# EAGLE design atmega8 dev board (EAGLE 5.01)
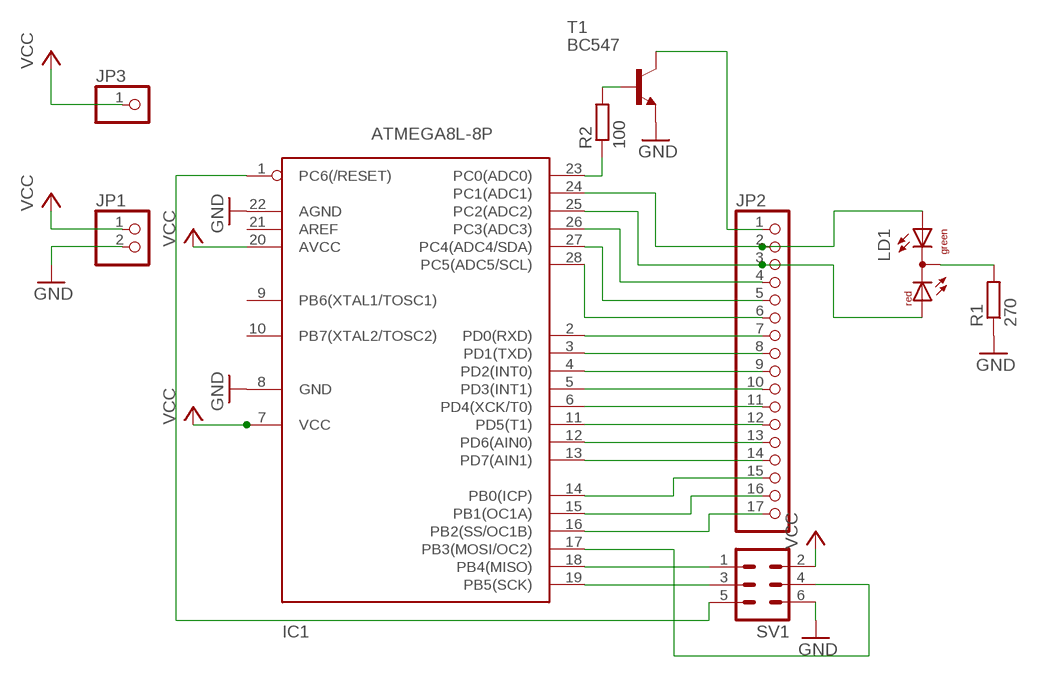
[diagram p0: schematic, sheet 1]

## Parts
IC1  ATMEGA8L-8P  [DIL28-3]
JP1  PINHD-1X2  [1X02]
JP2  PINHD-1X17  [1X17]
JP3  PINHD-1X1  [1X01]
LD1  DUOLED-RG-C  [DUOLED-C-5MM]
R1  270  R-EU_0207/10  [0207/10]
R2  100  R-EU_0207/10  [0207/10]
SV1  MA03-2  [MA03-2]
T1  BC547  [TO92]

## Nets
GND: IC1.8(GND) IC1.22(AGND) JP1.2 R1.1 SV1.6 T1.1(E)
N$1: IC1.18(PB4(MISO)) SV1.1
N$2: IC1.19(PB5(SCK)) SV1.3
N$3: IC1.23(PC0(ADC0)) R2.1
N$4: IC1.17(PB3(MOSI/OC2)) SV1.4
N$5: IC1.1(PC6(/RESET)) SV1.5
N$6: R2.2 T1.2(B)
N$7: IC1.16(PB2(SS/OC1B)) JP2.17
N$8: IC1.15(PB1(OC1A)) JP2.16
N$9: IC1.14(PB0(ICP)) JP2.15
N$10: IC1.13(PD7(AIN1)) JP2.14
N$11: IC1.12(PD6(AIN0)) JP2.13
N$12: IC1.11(PD5(T1)) JP2.12
N$13: IC1.6(PD4(XCK/T0)) JP2.11
N$14: IC1.5(PD3(INT1)) JP2.10
N$15: IC1.4(PD2(INT0)) JP2.9
N$16: IC1.3(PD1(TXD)) JP2.8
N$17: IC1.2(PD0(RXD)) JP2.7
N$18: IC1.28(PC5(ADC5/SCL)) JP2.6
N$19: IC1.27(PC4(ADC4/SDA)) JP2.5
N$20: IC1.26(PC3(ADC3)) JP2.4
N$21: IC1.25(PC2(ADC2)) JP2.3 LD1.AR
N$22: IC1.24(PC1(ADC1)) JP2.2 LD1.AX(AG)
N$23: JP2.1 T1.3(C)
N$24: LD1.C R1.2
VCC: IC1.7(VCC) IC1.20(AVCC) JP1.1 JP3.1 SV1.2
Unconnected: IC1.9(PB6(XTAL1/TOSC1)) IC1.10(PB7(XTAL2/TOSC2)) IC1.21(AREF)

## Library data of the parts
IC1 = avr:ATMEGA8*P: MICROCONTROLLER 8 Kbytes FLASH 1 kbytes SRAM 512 bytes EEPROM USART 4-channel 10 bit ADC 2-channel 8 bit ADC
JP1 = pinhead:PINHD-1X2: PIN HEADER
JP2 = pinhead:PINHD-1X17: PIN HEADER
JP3 = pinhead:PINHD-1X1: PIN HEADER
LD1 = led:DUOLED-RG-C: DUO LED 2 colors (red/green), 5 mm, round, common Cathode www.ligitek.com or other producers.
R1 = resistor:R-EU_: RESISTOR, European symbol
R2 = rcl:R-EU_: RESISTOR, European symbol
SV1 = con-lstb:MA03-2: PIN HEADER
T1 = transistor:BC547: NPN TRANSISTOR

## Board
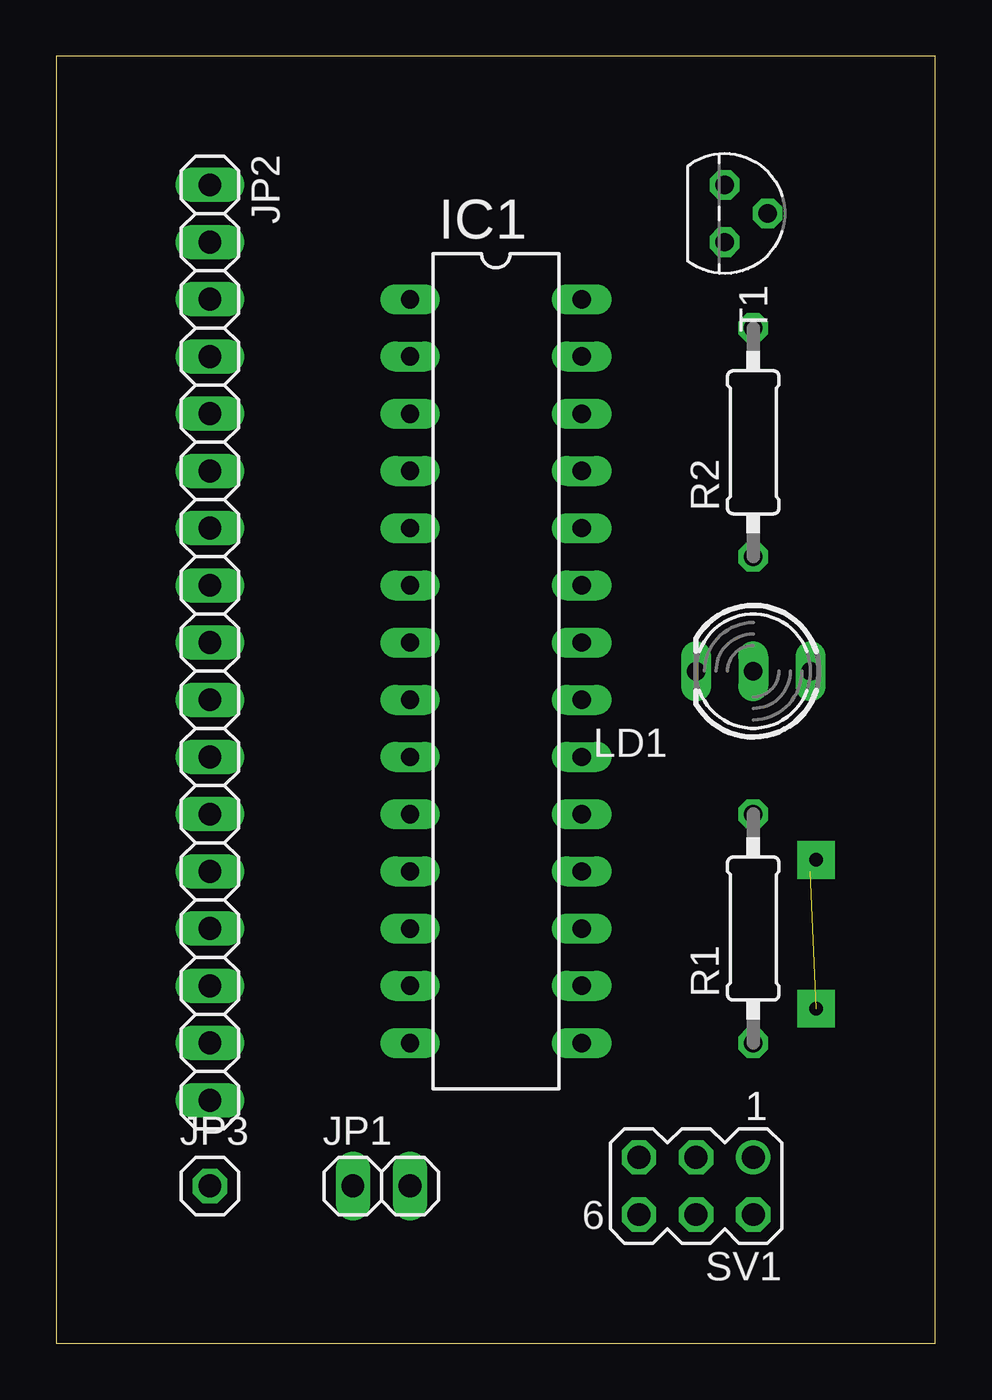
[diagram p1: board, top side]
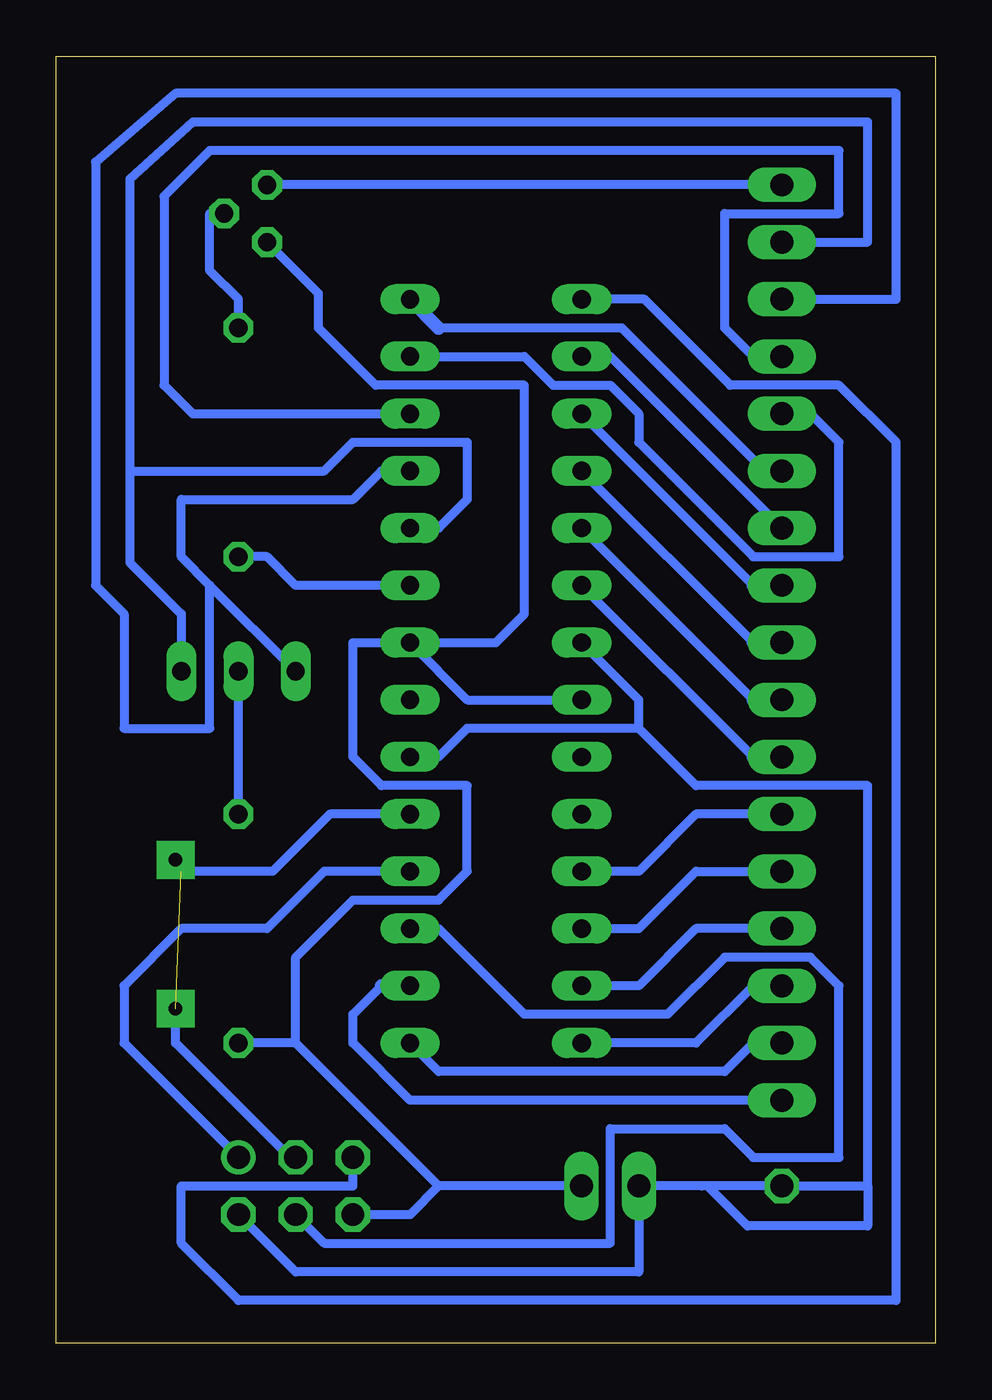
[diagram p2: board, bottom side, seen from below]

Size 39.04 x 57.14 mm. Coordinates in mm from the lower left corner, seen from the top.
Outline: 0,0 39.04,0 39.04,57.14 0,57.14 0,0
Copper layers (1*16): Top 0.035mm / dielectric 1.5mm / Bottom 0.035mm
Design rules "default": minimum track width 10mil, minimum drill 24mil, track to track 8mil, track to pad 8mil, pad to pad 8mil, via to via 8mil, smd to smd 8mil, copper to edge 40mil, drill to drill 8mil, minimum pad ring 10mil, minimum via ring 8mil, stop-mask expansion 4mil, vias tented up to drill 0mil, thermal gap 10mil

### Footprints (pad centres in the part's own frame; a part is rotated, then mirrored left to right if it is on the bottom)
DIL28-3 = drill 0.813 long: 1 -16.51,-3.81; 2 -13.97,-3.81; 3 -11.43,-3.81; 4 -8.89,-3.81; 5 -6.35,-3.81; 6 -3.81,-3.81; 7 -1.27,-3.81; 8 1.27,-3.81; 9 3.81,-3.81; 10 6.35,-3.81; 11 8.89,-3.81; 12 11.43,-3.81; 13 13.97,-3.81; 14 16.51,-3.81; 15 16.51,3.81; 16 13.97,3.81; 17 11.43,3.81; 18 8.89,3.81; 19 6.35,3.81; 20 3.81,3.81; 21 1.27,3.81; 22 -1.27,3.81; 23 -3.81,3.81; 24 -6.35,3.81; 25 -8.89,3.81; 26 -11.43,3.81; 27 -13.97,3.81; 28 -16.51,3.81
1X02 = drill 1.016 long: 1 -1.27,0; 2 1.27,0
1X17 = drill 1.016 long: 1 -20.32,0; 2 -17.78,0; 3 -15.24,0; 4 -12.7,0; 5 -10.16,0; 6 -7.62,0; 7 -5.08,0; 8 -2.54,0; 9 0,0; 10 2.54,0; 11 5.08,0; 12 7.62,0; 13 10.16,0; 14 12.7,0; 15 15.24,0; 16 17.78,0; 17 20.32,0
1X01 = drill 1.016 octagon: 1 0,0
DUOLED-C-5MM = drill 0.813 long: AR 2.54,0; AX -2.54,0; C 0,0
0207/10 = drill 0.813 octagon: 1 -5.08,0; 2 5.08,0
MA03-2 = drill 1.016 round: 1 -2.54,-1.27 | drill 1.016 octagon: 2 -2.54,1.27; 3 0,-1.27; 4 0,1.27; 5 2.54,-1.27; 6 2.54,1.27
TO92 = drill 0.813 octagon: 1 1.27,0; 2 0,1.905; 3 -1.27,0

### Placement (x,y rotation side)
IC1  19.52,29.84 270 top
JP1  14.44,6.98 0 top
JP2  6.82,31.11 270 top
JP3  6.82,6.98 0 top
LD1  30.95,29.84 180 top
R1  30.95,18.41 90 top
R2  30.95,40 90 top
SV1  28.41,6.98 180 top
T1  29.68,50.16 270 top

### Tracks (layer width: path | path; a pad name or v marks a point on that pad's centre or on a via)
GND
  Bottom 0.406: IC1.8 20.79,28.57 IC1.22 25.87,31.11 | JP1.2 22.06,6.98 | 22.06,6.98 23.33,5.71 SV1.6 | 28.41,13.33 R1.1 | 22.06,6.98 28.41,13.33 | 28.41,13.33 28.41,17.14 25.87,19.68 22.06,19.68 20.79,20.95 20.79,24.76 24.6,24.76 25.87,26.03 25.87,31.11 | 25.87,31.11 19.52,31.11 18.25,32.38 18.25,42.54 24.85,42.54 27.39,45.08 27.39,46.6 T1.1
N$1
  Bottom 0.406: SV1.1 36.03,13.33 36.03,15.87 33.49,18.41 29.68,18.41 27.14,20.95 IC1.18
N$2  (1 unrouted)
  Bottom 0.406: IC1.19 26.89,23.49 29.43,20.95 33.49,20.95 33.74,21.2 | SV1.3 28.66,8.25 33.74,13.33 33.74,14.85
N$3
  Bottom 0.406: IC1.23 28.41,33.65 29.68,34.92 R2.1
N$4
  Bottom 0.406: SV1.4 27.14,4.44 14.44,4.44 14.44,9.52 9.36,9.52 8.09,8.25 4.28,8.25 4.28,15.87 5.55,17.14 9.36,17.14 11.9,14.6 18.25,14.6 22.06,18.41 IC1.17
N$5
  Bottom 0.406: IC1.1 12.92,46.35 9.11,42.54 4.28,42.54 1.74,40 1.74,1.9 30.95,1.9 33.49,4.44 33.49,6.98 25.87,6.98 SV1.5
N$6
  Bottom 0.406: R2.2 30.95,46.35 32.22,47.62 32.22,50.16 T1.2
N$7
  Bottom 0.406: JP2.17 23.33,10.79 25.87,13.33 25.87,14.6 24.6,15.87
  Bottom 0.61: IC1.16 24.6,15.87
N$8
  Bottom 0.406: JP2.16 8.09,13.33 9.36,12.06 22.06,12.06 IC1.15
N$9
  Bottom 0.406: JP2.15 8.09,15.87 10.63,13.33 IC1.14
N$10
  Bottom 0.406: JP2.14 10.63,18.41 13.17,15.87 IC1.13
N$11
  Bottom 0.406: IC1.12 13.17,18.41 10.63,20.95 8.09,20.95
  Bottom 0.61: JP2.13 8.09,20.95
N$12
  Bottom 0.406: JP2.12 10.63,23.49 13.17,20.95 IC1.11
N$13
  Bottom 0.406: 8.09,26.03 IC1.6
  Bottom 0.61: JP2.11 8.09,26.03
N$14
  Bottom 0.406: 8.09,28.57 IC1.5
  Bottom 0.61: JP2.10 8.09,28.57
N$15
  Bottom 0.406: 8.09,31.11 IC1.4
  Bottom 0.61: JP2.9 8.09,31.11
N$16
  Bottom 0.406: 8.09,33.65 IC1.3
  Bottom 0.61: JP2.8 8.09,33.65
N$17
  Bottom 0.406: JP2.7 14.44,43.81 IC1.2
N$18
  Bottom 0.406: 7.58,38.73 13.93,45.08 22.06,45.08
  Bottom 0.61: JP2.6 7.58,38.73 | IC1.28 22.06,45.08
N$19
  Bottom 0.406: IC1.27 18.25,43.81 16.98,42.54 14.44,42.54 13.17,41.27 13.17,40 8.09,34.92 4.28,34.92 4.28,40 5.55,41.27 JP2.5
N$20
  Bottom 0.406: JP2.4 8.09,43.81 9.36,45.08 9.36,50.16 4.28,50.16 4.28,52.95 32.22,52.95 34.25,50.92 34.25,42.54 32.98,41.27 IC1.26
N$21
  Bottom 0.406: 32.22,33.65 LD1.AR | 32.22,33.65 33.49,34.92 33.49,37.46 25.87,37.46 24.6,38.73 IC1.25 | JP2.3 1.74,46.35 1.74,55.49 33.74,55.49 37.3,52.45 37.3,33.65 36.03,32.38 36.03,27.3 32.22,27.3 32.22,33.65
N$22
  Bottom 0.406: LD1.AX 33.49,32.38 35.78,34.67 35.78,38.73 | 35.78,38.73 27.14,38.73 25.87,40 20.79,40 20.79,37.46 22.06,36.19 IC1.24 | JP2.2 3.01,48.89 3.01,54.22 32.98,54.22 35.78,51.68 35.78,38.73
N$23
  Bottom 0.406: JP2.1 T1.3
N$24
  Bottom 0.406: R1.2 LD1.C
N$25  (via drill 0.6 pad 1.68)
  other vias: 33.74,14.85
N$26  (via drill 0.6 pad 1.68)
  other vias: 33.74,21.46
VCC
  Bottom 0.406: IC1.7 13.17,28.57 13.17,27.3 | 13.17,27.3 20.79,27.3 22.06,26.03 IC1.20 | 10.12,6.98 JP3.1 3.01,6.98 | 3.01,6.98 3.01,24.76 10.63,24.76 13.17,27.3 | SV1.2 28.41,3.17 13.17,3.17 JP1.1 10.38,6.98 10.12,6.98 | 3.01,6.98 3.01,5.2 8.34,5.2 10.12,6.98